# Altium project Iot_board_esp8266.PrjPcb (part 1 of 3)
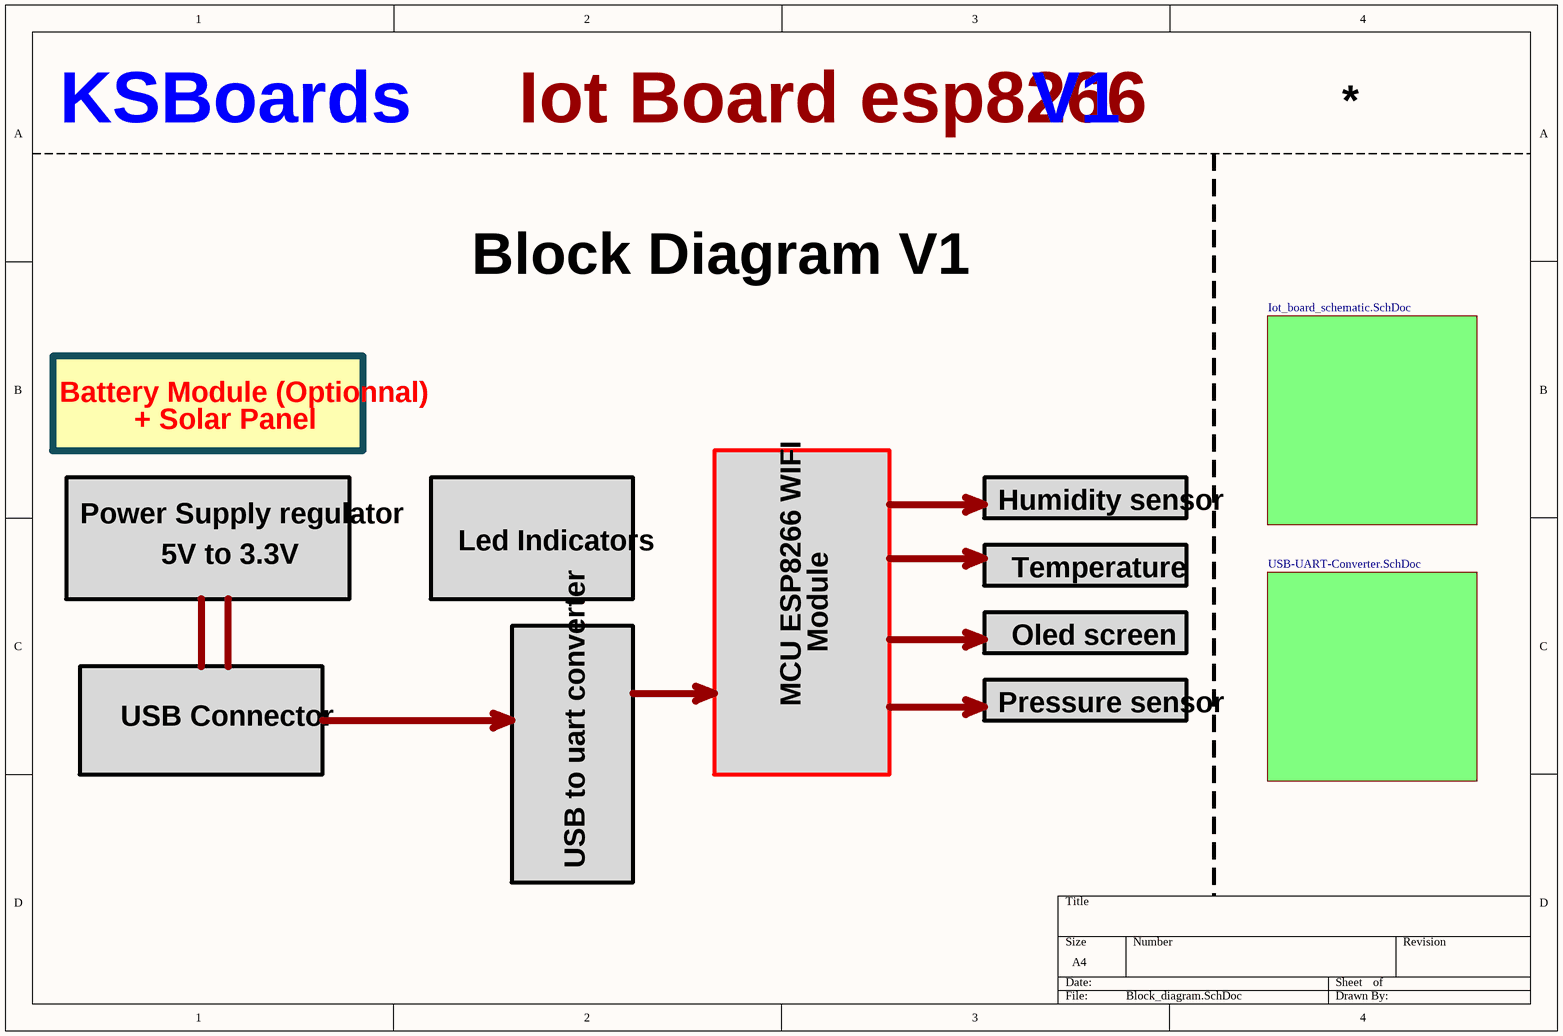
[diagram p0: Block_diagram.SchDoc]
.Version1: V1; .ProjectName: Iot Board esp8266; .CompanyName: KSBoards
3 sheets, 44 parts. Net scope: flat (ports and power ports of the same name join across sheets).
Board file: Iot_board_pcb.PcbDoc
Sheets:
  Block_diagram.SchDoc
     = Iot_board_schematic.SchDoc
    Designator = USB-UART-Converter.SchDoc

## Sheet Block_diagram.SchDoc
size A4; DocumentNumber: 1; SheetNumber: 1; SheetTotal: 3

### Sub-sheets
Designator = USB-UART-Converter.SchDoc: no entries
? = Iot_board_schematic.SchDoc: no entries

### Notes on the sheet
- Block Diagram V1
- Battery Module (Optionnal)
- + Solar Panel
- Humidity sensor
- Power Supply regulator
- 5V to 3.3V
- Led Indicators
- Temperature
- Module
- Oled screen
- MCU ESP8266 WIFI
- Pressure sensor
- USB Connector
- USB to uart converter

## Sheet Iot_board_schematic.SchDoc
size A4; DocumentNumber: 2; SheetNumber: 2; SheetTotal: 3
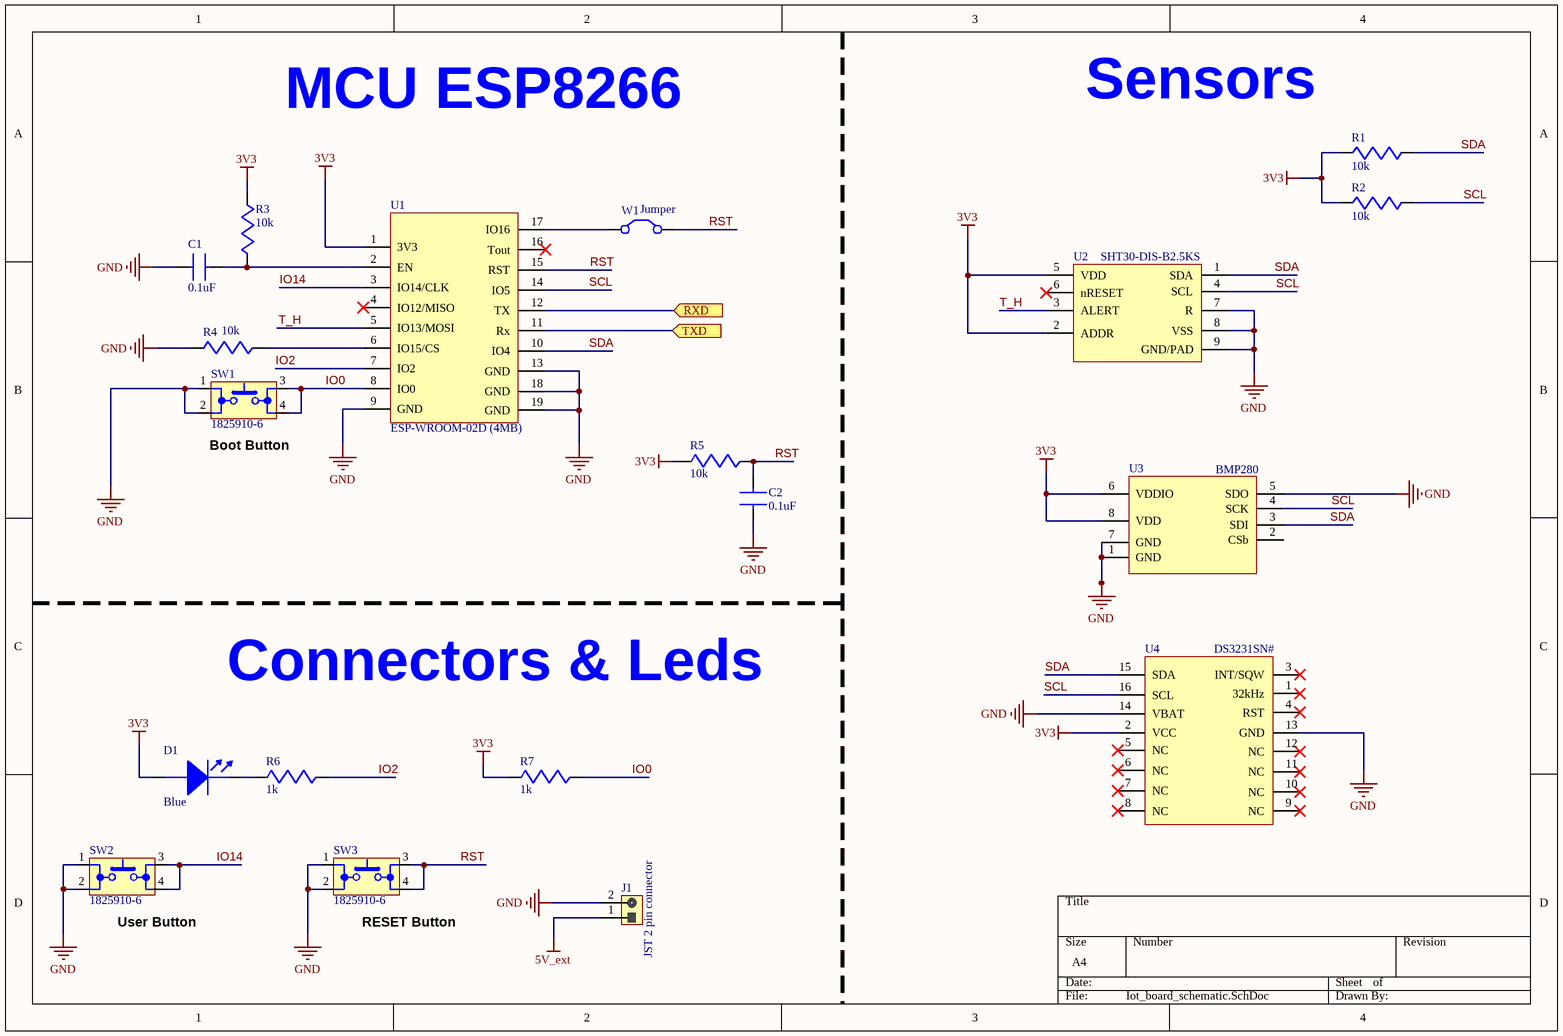
[diagram p1: Iot_board_schematic.SchDoc]

### Parts
C1  0.1uF  [C0603]
C2  0.1uF  [C0603]
D1  Blue  [LED_0603]
J1  JST 2 pin connector  [JST_2PINS]
R1  10k  [R0603]
R2  10k  [R0603]
R3  10k  [R0603]
R4  10k  [R0603]
R5  10k  [R0603]
R6  1k  [R0603]
R7  1k  [R0603]
SW1  1825910-6  [1825910-6]
SW2  1825910-6  [1825910-6]
SW3  1825910-6  [1825910-6]
U1  ESP-WROOM-02D (4MB)  [MODULE_ESP-WROOM-02]
U2  SHT30-DIS-B2.5KS  [QFN8]
U3  BMP280  [LGA8]
U4  DS3231SN#  [SOP16]
W1  Jumper  [RAD-0.2]

### Ports
RXD (in), TXD (in)

### Nets
3V3: D1.2(Anode) R1.1 R2.1 R3.2 R5.2 R7.2 U1.1(3V3) U2.2(ADDR) U2.5(VDD) U3.6(VDDIO) U3.8(VDD) U4.2(VCC)
5V_ext: J1.1
GND: C1.1 C2.1 J1.2 R4.2 SW1.1 SW1.2 SW2.1 SW2.2 SW3.1 SW3.2 U1.9(GND) U1.13(GND) U1.18(GND) U1.19(GND) U2.7(R) U2.8(VSS) U2.9(GND/PAD) U3.1(GND) U3.5(SDO) U3.7(GND) U4.13(GND) U4.14(VBAT)
IO0: R7.1 SW1.3 SW1.4 U1.8(IO0)
IO2: R6.1 U1.7(IO2)
IO14: SW2.3 SW2.4 U1.3(IO14/CLK)
RST: C2.2 R5.1 SW3.3 SW3.4 U1.15(RST) W1.2(C2)
RXD: U1.12(TX) ; port RXD
SCL: R2.2 U1.14(IO5) U2.4(SCL) U3.4(SCK) U4.16(SCL)
SDA: R1.2 U1.10(IO4) U2.1(SDA) U3.3(SDI) U4.15(SDA)
T_H: U1.5(IO13/MOSI) U2.3(ALERT)
TXD: U1.11(Rx) ; port TXD
NetC1_2: C1.2 R3.1 U1.2(EN)
NetD1_1: D1.1(Cathode) R6.2
NetR4_1: R4.1 U1.6(IO15/CS)
NetU1_17: U1.17(IO16) W1.1(C1)

Not connected (* = marked no-connect by the designer): U1 4(IO12/MISO)* 16(Tout)*; U2 6(nRESET)*; U3 2(CSb); U4 1(32kHz)* 3(INT/SQW)* 4(RST)* 5(NC)* 6(NC)* 7(NC)* 8(NC)* 9(NC)* 10(NC)* 11(NC)* 12(NC)*

### Notes on the sheet
- Sensors
- MCU ESP8266
- (near SW1) Boot Button
- Connectors & Leds
- (near SW2) User Button
- (near SW3) RESET Button

### Library data of the parts
C1 C2 = C0603C104K5RACTU: KEMET - C0603C104K5RACTU - SMD Multilayer Ceramic Capacitor, 0.1 µF, 50 V, 0603 [1608 Metric], ± 10%, X7R, C Series KEMET; Capacitance: 100nF; Voltage Rating: 50V; Dissipation Factor: 2.5%; Supplier 1: Digi-Key; Supplier Part Number 1: 399-5089-1-ND; Manufacturer: KEMET; Manufacturer Part Number: C0603C104K5RACTU; RoHS: Yes; Category: Ceramic Capacitors; Stock 1: 4652879; Pricing 1: 1=0,12000, 10=0,08500, 50=0,04620, 100=0,03770, 500=0,02696, 1000=0,02118 (USD); Mount: Surface Mount; Case/Package: 0603; Number of Pins: 2; Case Code (Metric): 1608; Case Code (Imperial): 0603; Dielectric Material: Ceramic; Contact Plating: Tin,Matte; Min Operating Temperature: -55°C; Max Operating Temperature: 125°C; Tolerance: 10%; Packaging: Tape and Reel; Dielectric: X7R; Voltage Rating (DC): 50V; Package Quantity: 1; Termination: SMD/SMT; Voltage: 50V; Series: SMD Comm X7R; Length: 0.063inch; Width: 0.031inch; Height: 0.8mm; Depth: 0.8mm; Thickness: 0.034inch; Lead Pitch: 0.7mm; Radiation Hardening: No; REACH SVHC: No SVHC; RoHS Compliant: Yes
D1 = LTST-C191TBKT: LED BLUE CLEAR 0603 SMD; Manufacturer: Vishay Lite-On; Lens Color: Colorless; Forward Voltage: 3.8V; Forward Current: 20mA; Viewing Angle: 130°; Lens Style: Diffused,Colorless,Clear,Rectangular; Dominant Wavelength: 475nm; Luminous Intensity: 180mcd; Wavelength: 468nm; Number of LEDs: 1; Reverse Voltage: 5V; Power Dissipation: 76mW; Max Power Dissipation: 75mW; Supplier 1: Digi-Key; Supplier Part Number 1: 160-1647-1-ND; Manufacturer Part Number: LTST-C191TBKT; RoHS: Yes; Category: LEDs; Stock 1: 244513; Pricing 1: 1=0,33000, 10=0,26200, 100=0,11780, 500=0,10640, 1000=0,08740, 2000=0,07600 (USD); Mount: Surface Mount; Case/Package: 0603; Number of Pins: 2; Color: Blue; Case Code (Metric): 1608; Case Code (Imperial): 0603; Min Operating Temperature: -20°C; Max Operating Temperature: 80°C; Packaging: Tape and Reel; Package Quantity: 1; Test Current: 20mA; Illumination Color: Blue; Lens Transparency: Clear; Number of Elements: 1; Length: 0.8mm; Width: 0.8mm; Height: 0.55mm; Depth: 1.6mm; Radiation Hardening: No; RoHS Compliant: Yes; Lead Free: Lead Free; ComponentLink1URL: https://datasheet.ciiva.com/2110/ltst-c191tbkt-2110256.pdf?src-supplier=Digi-Key; ComponentLink1Description: https://datasheet.ciiva.com/2110/ltst-c191tbkt-2110256.pdf?src-supplier=Digi-Key; ComponentLink2URL: https://datasheet.ciiva.com/12400/lite-on-ltst-c191tbkt-187207-12400737.pdf?src-supplier=Mouser; ComponentLink2Description: https://datasheet.ciiva.com/12400/lite-on-ltst-c191tbkt-187207-12400737.pdf?src-supplier=Mouser; ComponentLink3URL: https://datasheet.ciiva.com/19465/2047945-19465673.pdf?src-supplier=Jameco; ComponentLink3Description: https://datasheet.ciiva.com/19465/2047945-19465673.pdf?src-supplier=Jameco; ComponentLink4URL: https://datasheet.ciiva.com/11774/0900766b80dc02b4-11774413.pdf?src-supplier=RSComponents; ComponentLink4Description: https://datasheet.ciiva.com/11774/0900766b80dc02b4-11774413.pdf?src-supplier=RSComponents; ComponentLink5URL: https://datasheet.ciiva.com/15117/getdatasheetpartid-133342-15117680.pdf?src-supplier=Verical; ComponentLink5Description: https://datasheet.ciiva.com/15117/getdatasheetpartid-133342-15117680.pdf?src-supplier=Verical; ComponentLink6URL: https://datasheet.ciiva.com/16444/ltst-c191tbkt-16444756.pdf?src-supplier=Future+Electronics; ComponentLink6Description: https://datasheet.ciiva.com/16444/ltst-c191tbkt-16444756.pdf?src-supplier=Future+Electronics; ComponentLink7URL: https://datasheet.ciiva.com/26913/ltst-c191tbkt-26913718.pdf?src-supplier=IIIC; ComponentLink7Description: https://datasheet.ciiva.com/26913/ltst-c191tbkt-26913718.pdf?src-supplier=IIIC; ComponentLink8URL: https://datasheet.ciiva.com/2110/s-110-ltst-c191tbkt-2110257.pdf?src-supplier=Digi-Key; ComponentLink8Description: https://datasheet.ciiva.com/2110/s-110-ltst-c191tbkt-2110257.pdf?src-supplier=Digi-Key
J1 = S2B-PH-K-S(LF)(SN): Conn Shrouded Header (4 Sides) HDR 2 POS 2mm Solder RA Thru-Hole Box; Current Rating: 2A; Contact Resistance: 20mR; Number of Positions: 2; Insulation Resistance: 1GR; Gender: Male; Connector Type: Male Pin; Working Voltage: 100V; Supplier 1: Digi-Key; Supplier Part Number 1: 455-1719-ND; Manufacturer: JST; Manufacturer Part Number: S2B-PH-K-S(LF)(SN); RoHS: Yes; Category: Headers and Wire Housings; Stock 1: 305259; Pricing 1: 1=0,170000, 25=0,119600, 50=0,102600, 250=0,085440, 750=0,076890, 1000=0,071770, 12000=0,054680, 24000=0,049560, 48000=0,046140 (USD); Mount: Through Hole; Number of Pins: 2; Contact Material: Tin,Brass,Bronze; Contact Plating: Tin,Copper; Color: Natural,White; Housing Color: White; Housing Material: Polyamide; Min Operating Temperature: -25°C; Max Operating Temperature: 85°C; Number of Rows: 1; Packaging: Bulk; Termination: Solder; Fastening Type: Detent; Number of Contacts: 2; Orientation: Right Angle; Max Current Rating: 2A; Max Voltage Rating (AC): 100V; Number of Poles: 2; Voltage Rating (AC): 100V; Voltage Rating: 100V; Max Voltage Rating (DC): 100V; Length: 5.9mm; Width: 4.5mm; Height: 9.4mm; Pitch: 2mm; Depth: 7.6mm; Contact Mating Length: 0.13inch; Lead Pitch: 2mm; Lead Free: Lead Free; REACH SVHC: No SVHC; Flammability Rating: UL94 V-0; ComponentLink1URL: https://datasheet.ciiva.com/11747/0900766b8082f558-11747128.pdf?src-supplier=RSComponents; ComponentLink1Description: https://datasheet.ciiva.com/11747/0900766b8082f558-11747128.pdf?src-supplier=RSComponents; ComponentLink2URL: https://datasheet.ciiva.com/16484/s2b-ph-k-slfsn-16484405.pdf?src-supplier=Future+Electronics; ComponentLink2Description: https://datasheet.ciiva.com/16484/s2b-ph-k-slfsn-16484405.pdf?src-supplier=Future+Electronics; ComponentLink3URL: https://datasheet.ciiva.com/26894/getdatasheetpartid-641020-26894599.pdf?src-supplier=Verical; ComponentLink3Description: https://datasheet.ciiva.com/26894/getdatasheetpartid-641020-26894599.pdf?src-supplier=Verical; ComponentLink4URL: https://datasheet.ciiva.com/712/eph-712447.pdf?src-supplier=Digi-Key; ComponentLink4Description: https://datasheet.ciiva.com/712/eph-712447.pdf?src-supplier=Digi-Key; ComponentLink5URL: https://datasheet.ciiva.com/8052/80564-8052207.pdf?src-supplier=Element14; ComponentLink5Description: https://datasheet.ciiva.com/8052/80564-8052207.pdf?src-supplier=Element14
R1-R5 = CRCW060310K0FKEA: VISHAY - CRCW060310K0FKEA - SMD Chip Resistor, 0603 [1608 Metric], 10 kohm, CRCW e3 Series, 75 V, Thick Film, 100 mW; Resistance: 10kR; Power Rating: 100mW; Voltage Rating: 75V; Temperature Coefficient: 100ppm/°C; Tolerance: 1%; Supplier 1: Digi-Key; Supplier Part Number 1: 541-10.0KHCT-ND; Manufacturer: Vishay; Manufacturer Part Number: CRCW060310K0FKEA; RoHS: Yes; Category: Chip SMD Resistors; Pricing 1: 1=0,10000, 10=0,03400, 100=0,01390, 1000=0,00624, 2500=0,00542 (USD); Case/Package: 0603; Number of Pins: 2; Case Code (Metric): 1608; Case Code (Imperial): 0603; Contact Plating: Tin,Lead; Weight: 7.1E-05oz; Size Code: 0603; Min Operating Temperature: -55°C; Max Operating Temperature: 155°C; Packaging: Tape and Reel; Package Quantity: 10; Termination: SMD/SMT; Resistor Type: Thick Film; Series: CRCW; Resistance Tolerance: 1%; Max Power Dissipation: 100mW; Voltage Rating (DC): 75V; Number of Terminations: 2; Features: Automotive AEC-Q200; Construction: Rectangular; Technology: THICK FILM; Length: 1.55mm; Width: 0.033inch; Height: 0.45mm; Depth: 0.85mm; Radiation Hardening: No; REACH SVHC: Unknown; Military Standard: Not; Lead Free: Lead Free; RoHS Compliant: Yes; ComponentLink1URL: https://datasheet.ciiva.com/11809/0900766b80d98afc-11809037.pdf?src-supplier=RSComponents; ComponentLink1Description: https://datasheet.ciiva.com/11809/0900766b80d98afc-11809037.pdf?src-supplier=RSComponents; ComponentLink2URL: https://datasheet.ciiva.com/16886/dcrcw-16886037.pdf?src-supplier=Avnet+Europe; ComponentLink2Description: https://datasheet.ciiva.com/16886/dcrcw-16886037.pdf?src-supplier=Avnet+Europe; ComponentLink3URL: https://datasheet.ciiva.com/26821/getdatasheetpartid-86831-26821109.pdf?src-supplier=Verical; ComponentLink3Description: https://datasheet.ciiva.com/26821/getdatasheetpartid-86831-26821109.pdf?src-supplier=Verical; ComponentLink4URL: https://datasheet.ciiva.com/16754/70201119-16754710.pdf?src-supplier=Allied+Electronics; ComponentLink4Description: https://datasheet.ciiva.com/16754/70201119-16754710.pdf?src-supplier=Allied+Electronics; ComponentLink5URL: https://datasheet.ciiva.com/16719/70201119-16719704.pdf?src-supplier=Allied+Electronics; ComponentLink5Description: https://datasheet.ciiva.com/16719/70201119-16719704.pdf?src-supplier=Allied+Electronics; ComponentLink6URL: https://datasheet.ciiva.com/2465/dcrcwe3-2465513.pdf?src-supplier=Digi-Key; ComponentLink6Description: https://datasheet.ciiva.com/2465/dcrcwe3-2465513.pdf?src-supplier=Digi-Key; ComponentLink7URL: https://datasheet.ciiva.com/5543/dcrcwe3-109170-5543001.pdf?src-supplier=Mouser; ComponentLink7Description: https://datasheet.ciiva.com/5543/dcrcwe3-109170-5543001.pdf?src-supplier=Mouser; ComponentLink8URL: https://datasheet.ciiva.com/2465/dcrcwe3-2465514.pdf?src-supplier=Digi-Key; ComponentLink8Description: https://datasheet.ciiva.com/2465/dcrcwe3-2465514.pdf?src-supplier=Digi-Key; ComponentLink9URL: https://datasheet.ciiva.com/46385/1697337-46385498.pdf?src-supplier=Element14; ComponentLink9Description: https://datasheet.ciiva.com/46385/1697337-46385498.pdf?src-supplier=Element14; ComponentLink10URL: https://datasheet.ciiva.com/2465/dcrcwe3-2465515.pdf?src-supplier=Digi-Key; ComponentLink10Description: https://datasheet.ciiva.com/2465/dcrcwe3-2465515.pdf?src-supplier=Digi-Key; ComponentLink11URL: https://datasheet.ciiva.com/3256/dcrcwe3-3256939.pdf?src-supplier=Avnet; ComponentLink11Description: https://datasheet.ciiva.com/3256/dcrcwe3-3256939.pdf?src-supplier=Avnet; ComponentLink12URL: https://datasheet.ciiva.com/3256/dcrcwe3-3256940.pdf?src-supplier=Avnet; ComponentLink12Description: https://datasheet.ciiva.com/3256/dcrcwe3-3256940.pdf?src-supplier=Avnet; ComponentLink13URL: https://datasheet.ciiva.com/16209/dcrcwe3-16209164.pdf?src-supplier=Future+Electronics; ComponentLink13Description: https://datasheet.ciiva.com/16209/dcrcwe3-16209164.pdf?src-supplier=Future+Electronics; ComponentLink14URL: https://datasheet.ciiva.com/26314/fld-crcw-e3-data-en-26314749.pdf?src-supplier=Distrelec; ComponentLink14Description: https://datasheet.ciiva.com/26314/fld-crcw-e3-data-en-26314749.pdf?src-supplier=Distrelec
R6 R7 = CRCW06031K00FKEA: VISHAY - CRCW06031K00FKEA - SMD Chip Resistor, 0603 [1608 Metric], 1 kohm, CRCW e3 Series, 75 V, Thick Film, 100 mW; Manufacturer: Vishay Dale; Resistance: 1kR; Power Rating: 100mW; Tolerance: 1%; Temperature Coefficient: 100ppm/°C; Voltage Rating: 75V; Supplier 1: Digi-Key; Supplier Part Number 1: 541-1.00KHCT-ND; Manufacturer Part Number: CRCW06031K00FKEA; RoHS: Yes; Category: Chip SMD Resistors; Stock 1: 198661; Pricing 1: 1=0,10000, 10=0,03400, 100=0,01390, 1000=0,00624, 2500=0,00542 (USD); Mount: Surface Mount; Case/Package: 0603; Number of Pins: 2; Case Code (Metric): 1608; Case Code (Imperial): 0603; Contact Plating: Tin; Weight: 7.1E-05oz; Size Code: 0603; Min Operating Temperature: -55°C; Max Operating Temperature: 155°C; Packaging: Tape and Reel; Max Power Dissipation: 100mW; Series: CRCW; Resistor Type: Thick Film; Package Quantity: 10; Number of Terminations: 2; Termination: SMD/SMT; Resistance Tolerance: 1%; Voltage Rating (DC): 75V; Construction: Rectangular; Features: Automotive AEC-Q200; Technology: THICK FILM; Length: 1.55mm; Width: 0.033inch; Height: 0.45mm; Depth: 0.85mm; Radiation Hardening: No; REACH SVHC: Unknown; RoHS Compliant: Yes; Military Standard: Not; Lead Free: Lead Free; ComponentLink1URL: https://datasheet.ciiva.com/11808/0900766b80d98afc-11808625.pdf?src-supplier=RSComponents; ComponentLink1Description: https://datasheet.ciiva.com/11808/0900766b80d98afc-11808625.pdf?src-supplier=RSComponents; ComponentLink2URL: https://datasheet.ciiva.com/2465/dcrcwe3-2465536.pdf?src-supplier=Digi-Key; ComponentLink2Description: https://datasheet.ciiva.com/2465/dcrcwe3-2465536.pdf?src-supplier=Digi-Key; ComponentLink3URL: https://datasheet.ciiva.com/8336/dcrcwe3-8336822.pdf?src-supplier=Avnet; ComponentLink3Description: https://datasheet.ciiva.com/8336/dcrcwe3-8336822.pdf?src-supplier=Avnet; ComponentLink4URL: https://datasheet.ciiva.com/16515/dcrcwe3-16515078.pdf?src-supplier=Avnet+Asia; ComponentLink4Description: https://datasheet.ciiva.com/16515/dcrcwe3-16515078.pdf?src-supplier=Avnet+Asia; ComponentLink5URL: https://datasheet.ciiva.com/46441/1720486-46441622.pdf?src-supplier=Element14; ComponentLink5Description: https://datasheet.ciiva.com/46441/1720486-46441622.pdf?src-supplier=Element14; ComponentLink6URL: https://datasheet.ciiva.com/26316/fld-crcw-e3-data-en-26316551.pdf?src-supplier=Distrelec; ComponentLink6Description: https://datasheet.ciiva.com/26316/fld-crcw-e3-data-en-26316551.pdf?src-supplier=Distrelec; ComponentLink7URL: https://datasheet.ciiva.com/46441/1720486-46441623.pdf?src-supplier=Element14; ComponentLink7Description: https://datasheet.ciiva.com/46441/1720486-46441623.pdf?src-supplier=Element14; ComponentLink8URL: https://datasheet.ciiva.com/46385/1697337-46385497.pdf?src-supplier=Element14; ComponentLink8Description: https://datasheet.ciiva.com/46385/1697337-46385497.pdf?src-supplier=Element14; ComponentLink9URL: https://datasheet.ciiva.com/3257/dcrcwe3-3257132.pdf?src-supplier=Avnet; ComponentLink9Description: https://datasheet.ciiva.com/3257/dcrcwe3-3257132.pdf?src-supplier=Avnet; ComponentLink10URL: https://datasheet.ciiva.com/16199/dcrcwe3-16199053.pdf?src-supplier=Future+Electronics; ComponentLink10Description: https://datasheet.ciiva.com/16199/dcrcwe3-16199053.pdf?src-supplier=Future+Electronics; ComponentLink11URL: https://datasheet.ciiva.com/2465/dcrcwe3-2465534.pdf?src-supplier=Digi-Key; ComponentLink11Description: https://datasheet.ciiva.com/2465/dcrcwe3-2465534.pdf?src-supplier=Digi-Key; ComponentLink12URL: https://datasheet.ciiva.com/16893/dcrcwe3-16893742.pdf?src-supplier=Avnet+Europe; ComponentLink12Description: https://datasheet.ciiva.com/16893/dcrcwe3-16893742.pdf?src-supplier=Avnet+Europe; ComponentLink13URL: https://datasheet.ciiva.com/2465/dcrcwe3-2465535.pdf?src-supplier=Digi-Key; ComponentLink13Description: https://datasheet.ciiva.com/2465/dcrcwe3-2465535.pdf?src-supplier=Digi-Key
SW1-SW3 = 1825910-6: SWITCH TACTILE SPST-NO 0.05A 24V; Manufacturer: TE Connectivity Alcoswitch; Actuator Material: PBT; Mechanical Life: 100000Cycles; Operating Force: 160gf; Throw Configuration: SPST; Illumination Type: Non-Illuminated,Illuminated; Switch Travel: 0.25mm; Switch Function: Off-Mom; Contact Current Rating: 50mA; Actuator Type: Standard; Contact Resistance: 100mR; Actuator Length: 0.055inch; Supplier 1: Digi-Key; Supplier Part Number 1: 450-1650-ND; Manufacturer Part Number: 1825910-6; RoHS: Yes; Category: Pushbutton Switches; Stock 1: 151652; Pricing 1: 1=0,10000, 10=0,10100, 25=0,09560, 100=0,08700, 250=0,08180, 500=0,07484, 1000=0,06265, 5000=0,05743, 10000=0,05395 (USD); Mount: Through Hole; Contact Material: Copper Alloy; Contact Plating: Silver; Min Operating Temperature: -35°C; Max Operating Temperature: 85°C; Termination: PC Pins; Package Quantity: 750; Packaging: Loose Piece; Orientation: Straight; Max Voltage Rating (DC): 24V; Electrical Life: 100000Cycles; Max Current Rating: 50mA; Type: Switch; Length: 5.99mm; REACH SVHC: Unknown; ELV: Compliant; Lead Free: Lead Free; ComponentLink1URL: https://datasheet.ciiva.com/30199/1825910-6rqpn1825910-6-30199520.pdf?src-supplier=Onlinecomponents.com; ComponentLink1Description: https://datasheet.ciiva.com/30199/1825910-6rqpn1825910-6-30199520.pdf?src-supplier=Onlinecomponents.com; ComponentLink2URL: https://datasheet.ciiva.com/15184/getdatasheetpartid-395915-15184509.pdf?src-supplier=Verical; ComponentLink2Description: https://datasheet.ciiva.com/15184/getdatasheetpartid-395915-15184509.pdf?src-supplier=Verical
U1 = ESP-WROOM-02D (4MB): Manufacturer: Espressif Systems; Supplier 1: Digi-Key; Supplier Part Number 1: 1965-ESP-WROOM-02D(4MB)CT-ND; Manufacturer Part Number: ESP-WROOM-02D (4MB); RoHS: No; Stock 1: 1303; Pricing 1: 1=3,20000 (USD)
U2 = SHT30-DIS-B2.5KS: Humidity/Temperature Sensor Digital Serial (I2C) 8-Pin DFN EP T/R; Manufacturer: Sensirion; Supplier 1: Digi-Key; Supplier Part Number 1: 1649-1009-1-ND; Manufacturer Part Number: SHT30-DIS-B2.5KS; RoHS: Yes; Stock 1: 45; Pricing 1: 1=2,78000, 10=2,52000, 25=2,25760, 50=1,99500, 100=1,94250, 500=1,62750, 1000=1,52250 (USD); RoHS Compliant: Yes
U3 = BMP280: BMP280 Absolute Barometric Pressure Sensor for Battery Powered Devices 2 x 2.5mm; Manufacturer: Bosch; Output Type: SPI,I2C; Operating Pressure: 15.95PSI; Port Style: No Port; Max Pressure: 290.08PSI; Supplier 1: Digi-Key; Supplier Part Number 1: 828-1064-1-ND; Manufacturer Part Number: BMP280; RoHS: No; Category: Pressure Sensors; Pricing 1: 1=3,26000, 5=3,02200, 10=2,51100, 25=2,09240, 50=1,86000, 100=1,76700, 500=1,48800, 1000=1,39500, 5000=1,30200 (USD); Case/Package: SMD/SMT; Number of Pins: 8; Min Operating Temperature: -40°C; Max Operating Temperature: 85°C; Pressure Type: Absolute; Termination: SMD/SMT; Lead Free: Lead Free; ComponentLink1URL: https://ae-bst.resource.bosch.com/media/_tech/media/datasheets/BST-BMP280-DS001.pdf?src-supplier=Digi-Key; ComponentLink1Description: https://ae-bst.resource.bosch.com/media/_tech/media/datasheets/BST-BMP280-DS001.pdf?src-supplier=Digi-Key
U4 = DS3231SN#: RTC, TCXO, CRYSTAL, 3.3V, 16SOIC; Manufacturer: Maxim; Logic Function: Clock; Time Format: HH:MM:SS; Max Supply Voltage: 5.5V; Min Supply Voltage: 2.3V; Interface: I2C,Serial,2-Wire; Date Format: YY-MM-DD-dd; Number of Outputs: 1; Frequency: 32.768kHz; Supplier 1: Digi-Key; Supplier Part Number 1: DS3231SN#-ND; Manufacturer Part Number: DS3231SN#; RoHS: Yes; Category: Real Time Clocks; Stock 1: 339; Pricing 1: 1=10,09000, 10=9,11600, 25=8,69240, 100=7,54760, 250=7,20832, 500=6,57232, 1000=5,77200 (USD); Mount: Surface Mount; Case/Package: SOIC; Number of Pins: 16; Weight: 0.023492oz; Min Operating Temperature: -40°C; Max Operating Temperature: 85°C; Operating Supply Voltage: 3.3V; Packaging: Bulk; Package Quantity: 46; Series: DS3231SN; Termination: SMD/SMT; Length: 10.5mm; Width: 7.6mm; Height: 2.35mm; Radiation Hardening: No; RoHS Compliant: Yes; Lead Free: Lead Free; REACH SVHC: Unknown; ComponentLink1URL: https://datasheet.ciiva.com/23867/45724-23867216.pdf?src-supplier=Newark; ComponentLink1Description: https://datasheet.ciiva.com/23867/45724-23867216.pdf?src-supplier=Newark; ComponentLink2URL: https://datasheet.ciiva.com/1240/ds3231-ds3231s-1240689.pdf?src-supplier=Digi-Key; ComponentLink2Description: https://datasheet.ciiva.com/1240/ds3231-ds3231s-1240689.pdf?src-supplier=Digi-Key; ComponentLink3URL: https://datasheet.ciiva.com/1146/ds3231-1146707.pdf?src-supplier=Newark; ComponentLink3Description: https://datasheet.ciiva.com/1146/ds3231-1146707.pdf?src-supplier=Newark; ComponentLink4URL: https://datasheet.ciiva.com/1139/1675711-1139210.pdf?src-supplier=Element14; ComponentLink4Description: https://datasheet.ciiva.com/1139/1675711-1139210.pdf?src-supplier=Element14; ComponentLink5URL: https://datasheet.ciiva.com/26795/ds3231sn-26795694.pdf?src-supplier=IIIC; ComponentLink5Description: https://datasheet.ciiva.com/26795/ds3231sn-26795694.pdf?src-supplier=IIIC; ComponentLink6URL: https://datasheet.ciiva.com/25889/ds3231-25889895.pdf?src-supplier=Avnet+Europe; ComponentLink6Description: https://datasheet.ciiva.com/25889/ds3231-25889895.pdf?src-supplier=Avnet+Europe; ComponentLink7URL: https://datasheet.ciiva.com/4772/ds3231-102175-4772091.pdf?src-supplier=Mouser; ComponentLink7Description: https://datasheet.ciiva.com/4772/ds3231-102175-4772091.pdf?src-supplier=Mouser; ComponentLink8URL: https://datasheet.ciiva.com/14244/ds3231-14244059.pdf?src-supplier=Avnet; ComponentLink8Description: https://datasheet.ciiva.com/14244/ds3231-14244059.pdf?src-supplier=Avnet; ComponentLink9URL: https://datasheet.ciiva.com/12291/ds3231-102175-12291423.pdf?src-supplier=Mouser; ComponentLink9Description: https://datasheet.ciiva.com/12291/ds3231-102175-12291423.pdf?src-supplier=Mouser
W1 = Jumper: Jumper Wire; Published: 24-Mar-1999; LatestRevisionDate: 17-Jul-2002; LatestRevisionNote: Re-released for DXP Platform.; PackageReference: RAD-0.2; Publisher: Altium Limited; PackageDescription: Radial Cap, Thru-Hole; 2 Leads; 0.2 in Pin Spacing

## Sheet USB-UART-Converter.SchDoc
size A4; DocumentNumber: 3; SheetNumber: 3; SheetTotal: 3
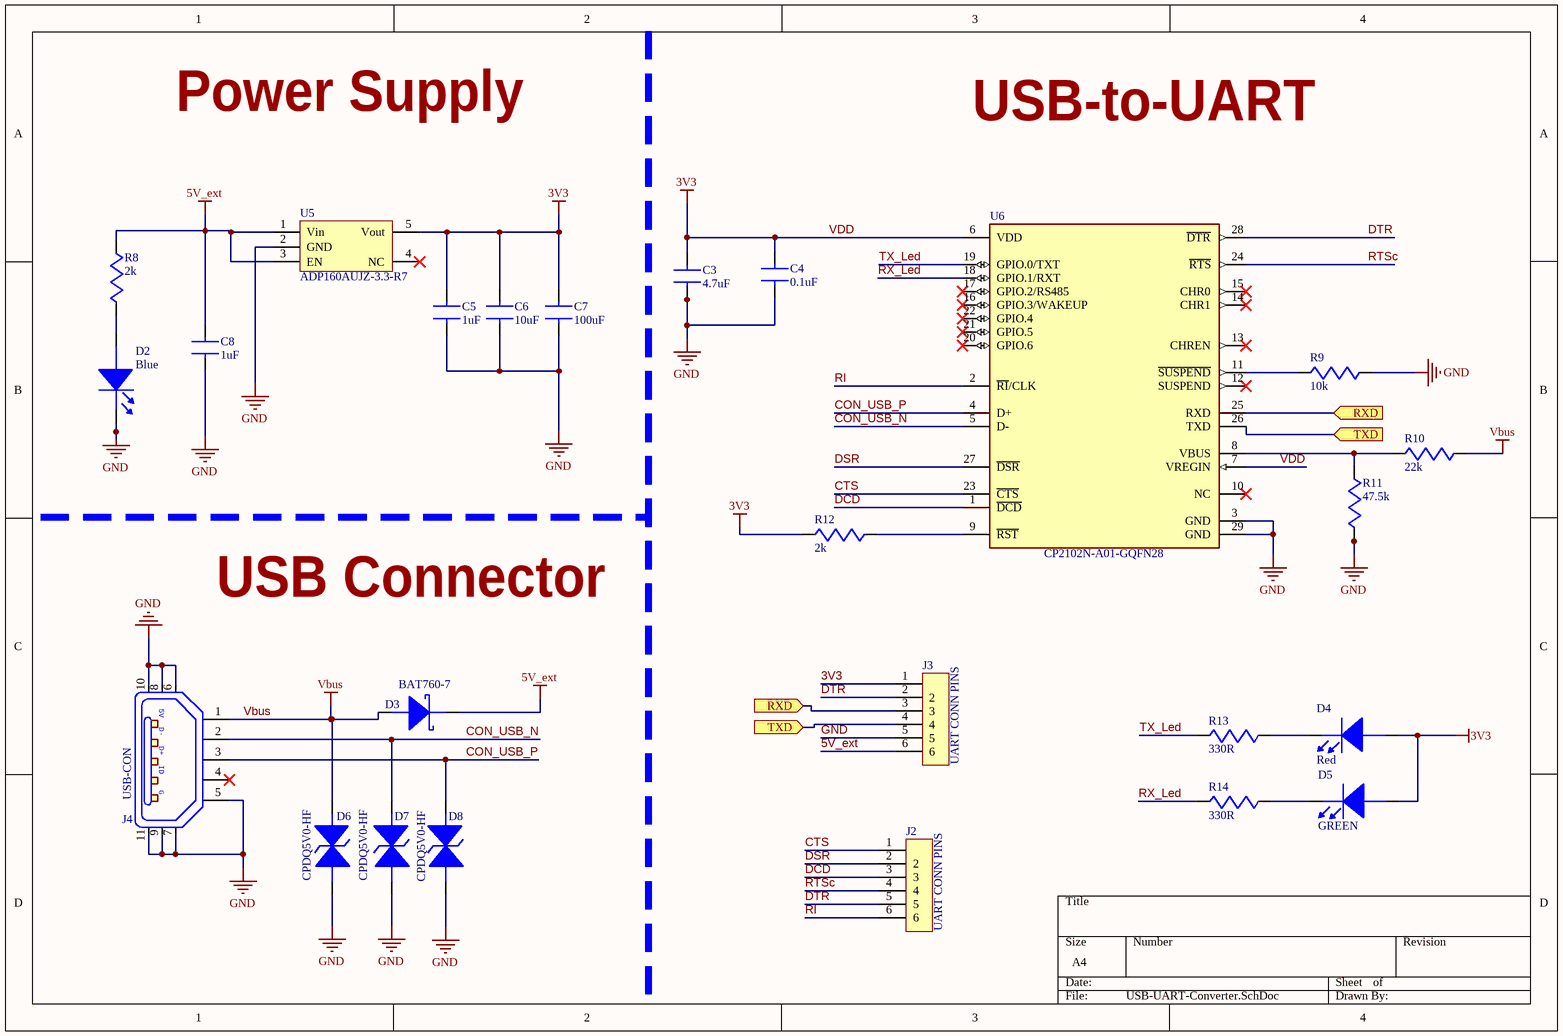
[diagram p2: USB-UART-Converter.SchDoc]

### Parts
C3  4.7uF  [C0603]
C4  0.1uF  [C0603]
C5  1uF  [C0603]
C6  10uF  [C0603]
C7  100uF  [C1206]
C8  1uF  [C0603]
D2  Blue  [LED_0603]
D3  BAT760-7  [SOD323]
D4  Red  [LED_0603]
D5  GREEN  [LED_0603]
D6  CPDQ5V0-HF  [SOD-923F]
D7  CPDQ5V0-HF  [SOD-923F]
D8  CPDQ5V0-HF  [SOD-923F]
J2  UART CONN PINS  [HDR_FEMALE_1x6_2.54mm]  (no BOM)
J3  UART CONN PINS  [HDR_FEMALE_1x6_2.54mm]  (no BOM)
J4  USB-CON  [10118193]
R8  2k  [R0603]
R9  10k  [R0603]
R10  22k  [R0603]
R11  47.5k  [R0603]
R12  2k  [R0603]
R13  330R  [R0603]
R14  330R  [R0603]
U5  ADP160AUJZ-3.3-R7  [SOT95]
U6  CP2102N-A01-GQFN28  [FP-CP2102N-A01-GQFN28-IPC_A]

### Ports
RXD (in), TXD (in)

### Nets
3V3: C3.2 C4.2 C5.2 C6.2 C7.2 D4.2(Anode) D5.2(Anode) J3.1 R12.1 U5.5(Vout) U6.6(VDD) U6.7(VREGIN)  [also labelled VDD]
5V_ext: C8.2 D3.1(Cathode) J3.6 R8.2 U5.1(Vin) U5.3(EN)
GND: C3.1 C4.1 C5.1 C6.1 C7.1 C8.1 D2.1(Cathode) D6.2(Anode) D7.2(Anode) D8.2(Anode) J3.5 J4.5 J4.6 J4.7 J4.8 J4.9 J4.10 J4.11 R9.2 R11.1 U5.2(GND) U6.3(GND) U6.29(GND)
Vbus: D3.2(Anode) D6.1(Cathode) J4.1 R10.2
CON_USB_N: D7.1(Cathode) J4.2 U6.5(D-)
CON_USB_P: D8.1(Cathode) J4.3 U6.4(D+)
CTS: J2.1 U6.23(~{CTS})
DCD: J2.3 U6.1(~{DCD})
DSR: J2.2 U6.27(~{DSR})
DTR: J2.5 J3.2 U6.28(~{DTR})
RI: J2.6 U6.2(~{RI}/CLK)
RTSc: J2.4 U6.24(~{RTS})
RX_Led: R14.1 U6.18(GPIO.1/RXT)
RXD: J3.3 U6.25(RXD) ; port RXD
TX_Led: R13.1 U6.19(GPIO.0/TXT)
TXD: J3.4 U6.26(TXD) ; port TXD
NetD2_2: D2.2(Anode) R8.1
NetD4_1: D4.1(Cathode) R13.2
NetD5_1: D5.1(Cathode) R14.2
NetR9_1: R9.1 U6.11(~{SUSPEND})
NetR10_1: R10.1 R11.2 U6.8(VBUS)
NetR12_2: R12.2 U6.9(~{RST})

Not connected (* = marked no-connect by the designer): J4 4*; U5 4(NC)*; U6 10(NC)* 12(SUSPEND)* 13(CHREN)* 14(CHR1)* 15(CHR0)* 16(GPIO.3/WAKEUP)* 17(GPIO.2/RS485)* 20(GPIO.6)* 21(GPIO.5)* 22(GPIO.4)*

### Notes on the sheet
- Power Supply
- USB-to-UART
- USB Connector
- (in symbol 10118193-0001LF) 5V; D-; D+; ID; G